# Altium schematic sheet opto_board_v1.0.SchDoc: Fixture Electronics Design
size A4; Revision: 1.0; SheetNumber: 1; SheetTotal: 1
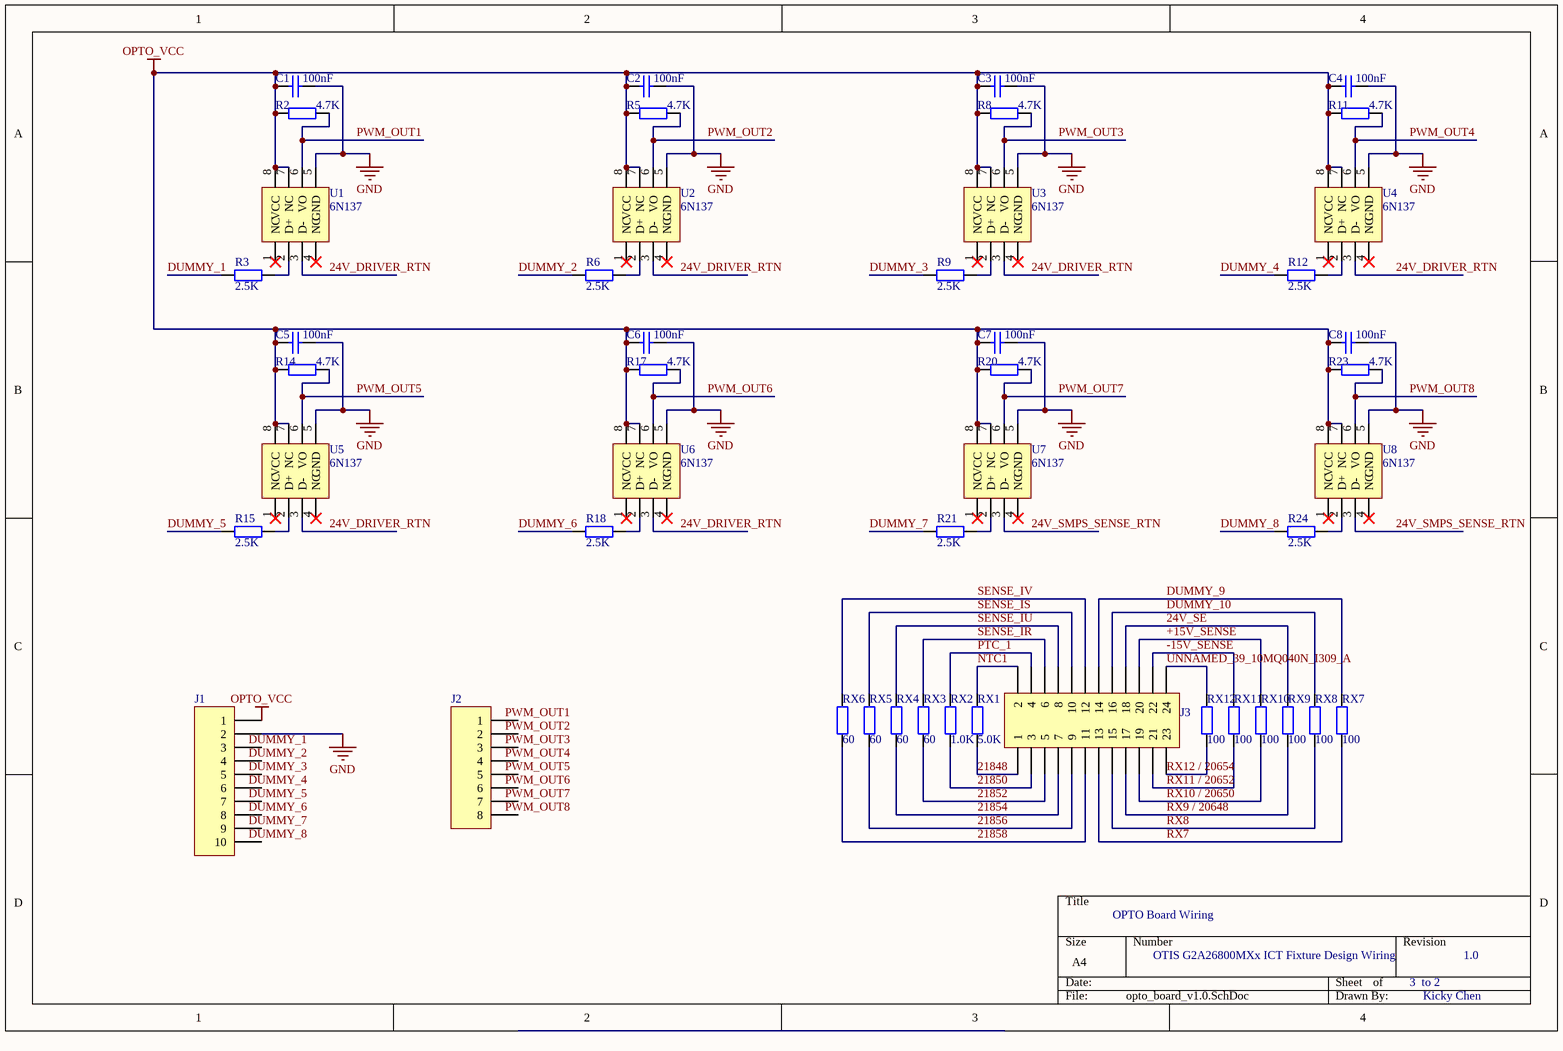
[diagram p0: opto_board_v1.0.SchDoc]

## Parts
C1  value 100nF  [RAD-0.3]  (hidden comment: Cap)
C2  value 100nF  [RAD-0.3]  (hidden comment: Cap)
C3  value 100nF  [RAD-0.3]  (hidden comment: Cap)
C4  value 100nF  [RAD-0.3]  (hidden comment: Cap)
C5  value 100nF  [RAD-0.3]  (hidden comment: Cap)
C6  value 100nF  [RAD-0.3]  (hidden comment: Cap)
C7  value 100nF  [RAD-0.3]  (hidden comment: Cap)
C8  value 100nF  [RAD-0.3]  (hidden comment: Cap)
J1  Header 10  [HDR1X10]  (value not drawn)
J2  Header 8  [HDR1X8]  (value not drawn)
J3  Header 12X2  [HDR2X12]  (value not drawn)
R2  value 4.7K  [AXIAL-0.4]  (hidden comment: Res2)
R3  value 2.5K  [AXIAL-0.4]  (hidden comment: Res2)
R5  value 4.7K  [AXIAL-0.4]  (hidden comment: Res2)
R6  value 2.5K  [AXIAL-0.4]  (hidden comment: Res2)
R8  value 4.7K  [AXIAL-0.4]  (hidden comment: Res2)
R9  value 2.5K  [AXIAL-0.4]  (hidden comment: Res2)
R11  value 4.7K  [AXIAL-0.4]  (hidden comment: Res2)
R12  value 2.5K  [AXIAL-0.4]  (hidden comment: Res2)
R14  value 4.7K  [AXIAL-0.4]  (hidden comment: Res2)
R15  value 2.5K  [AXIAL-0.4]  (hidden comment: Res2)
R17  value 4.7K  [AXIAL-0.4]  (hidden comment: Res2)
R18  value 2.5K  [AXIAL-0.4]  (hidden comment: Res2)
R20  value 4.7K  [AXIAL-0.4]  (hidden comment: Res2)
R21  value 2.5K  [AXIAL-0.4]  (hidden comment: Res2)
R23  value 4.7K  [AXIAL-0.4]  (hidden comment: Res2)
R24  value 2.5K  [AXIAL-0.4]  (hidden comment: Res2)
RX1  value 5.0K  [AXIAL-0.4]  (hidden comment: Res2)
RX2  value 1.0K  [AXIAL-0.4]  (hidden comment: Res2)
RX3  value 60  [AXIAL-0.4]  (hidden comment: Res2)
RX4  value 60  [AXIAL-0.4]  (hidden comment: Res2)
RX5  value 60  [AXIAL-0.4]  (hidden comment: Res2)
RX6  value 60  [AXIAL-0.4]  (hidden comment: Res2)
RX7  value 100  [AXIAL-0.4]  (hidden comment: Res2)
RX8  value 100  [AXIAL-0.4]  (hidden comment: Res2)
RX9  value 100  [AXIAL-0.4]  (hidden comment: Res2)
RX10  value 100  [AXIAL-0.4]  (hidden comment: Res2)
RX11  value 100  [AXIAL-0.4]  (hidden comment: Res2)
RX12  value 100  [AXIAL-0.4]  (hidden comment: Res2)
U1  6N137  [DIP8]
U2  6N137  [DIP8]
U3  6N137  [DIP8]
U4  6N137  [DIP8]
U5  6N137  [DIP8]
U6  6N137  [DIP8]
U7  6N137  [DIP8]
U8  6N137  [DIP8]

## Nets
GND: C1.1 C2.1 C3.1 C4.1 C5.1 C6.1 C7.1 C8.1 J1.2 U1.5(GND) U2.5(GND) U3.5(GND) U4.5(GND) U5.5(GND) U6.5(GND) U7.5(GND) U8.5(GND)
OPTO_VCC: C1.2 C2.2 C3.2 C4.2 C5.2 C6.2 C7.2 C8.2 J1.1 R2.2 R5.2 R8.2 R11.2 R14.2 R17.2 R20.2 R23.2 U1.7(NC) U1.8(VCC) U2.7(NC) U2.8(VCC) U3.7(NC) U3.8(VCC) U4.7(NC) U4.8(VCC) U5.7(NC) U5.8(VCC) U6.7(NC) U6.8(VCC) U7.7(NC) U7.8(VCC) U8.7(NC) U8.8(VCC)
24V_DRIVER_RTN: U1.3(D-) U2.3(D-) U3.3(D-) U4.3(D-) U5.3(D-) U6.3(D-)
24V_SE: J3.18 RX9.1
24V_SMPS_SENSE_RTN: U7.3(D-) U8.3(D-)
21848: J3.1 RX1.2
21850: J3.3 RX2.2
21852: J3.5 RX3.2
21854: J3.7 RX4.2
21856: J3.9 RX5.2
21858: J3.11 RX6.2
+15V_SENSE: J3.20 RX10.1
-15V_SENSE: J3.22 RX11.1
DUMMY_1: R3.2
DUMMY_2: R6.2
DUMMY_3: R9.2
DUMMY_4: R12.2
DUMMY_5: R15.2
DUMMY_6: R18.2
DUMMY_7: R21.2
DUMMY_8: R24.2
DUMMY_9: J3.14 RX7.1
DUMMY_10: J3.16 RX8.1
NTC1: J3.2 RX1.1
PTC_1: J3.4 RX2.1
PWM_OUT1: R2.1 U1.6(VO)
PWM_OUT2: R5.1 U2.6(VO)
PWM_OUT3: R8.1 U3.6(VO)
PWM_OUT4: R11.1 U4.6(VO)
PWM_OUT5: R14.1 U5.6(VO)
PWM_OUT6: R17.1 U6.6(VO)
PWM_OUT7: R20.1 U7.6(VO)
PWM_OUT8: R23.1 U8.6(VO)
RX7: J3.13 RX7.2
RX8: J3.15 RX8.2
RX9 / 20648: J3.17 RX9.2
RX10 / 20650: J3.19 RX10.2
RX11 / 20652: J3.21 RX11.2
RX12 / 20654: J3.23 RX12.2
SENSE_IR: J3.6 RX3.1
SENSE_IS: J3.10 RX5.1
SENSE_IU: J3.8 RX4.1
SENSE_IV: J3.12 RX6.1
UNNAMED_39_10MQ040N_I309_A: J3.24 RX12.1
NetR3_1: R3.1 U1.2(D+)
NetR6_1: R6.1 U2.2(D+)
NetR9_1: R9.1 U3.2(D+)
NetR12_1: R12.1 U4.2(D+)
NetR15_1: R15.1 U5.2(D+)
NetR18_1: R18.1 U6.2(D+)
NetR21_1: R21.1 U7.2(D+)
NetR24_1: R24.1 U8.2(D+)

Not connected (* = marked no-connect by the designer): J1 3 4 5 6 7 8 9 10; J2 1 2 3 4 5 6 7 8; U1 1(NC)* 4(NC)*; U2 1(NC)* 4(NC)*; U3 1(NC)* 4(NC)*; U4 1(NC)* 4(NC)*; U5 1(NC)* 4(NC)*; U6 1(NC)* 4(NC)*; U7 1(NC)* 4(NC)*; U8 1(NC)* 4(NC)*

## Notes on the sheet
- OPTO Board Wiring
- OTIS G2A26800MXx ICT Fixture Design Wiring
- 3  to 2
- 1.0
- Kicky Chen
- Labels drawn without touching a wire or pin: DUMMY_1, DUMMY_2, DUMMY_3, DUMMY_4, DUMMY_5, DUMMY_6, DUMMY_7, DUMMY_8, PWM_OUT1, PWM_OUT2, PWM_OUT3, PWM_OUT4, PWM_OUT5, PWM_OUT6, PWM_OUT7, PWM_OUT8

## Library data of the parts
C1-C8 = Cap: Capacitor; Published: 8-Jun-2000; LatestRevisionDate: 17-Jul-2002; LatestRevisionNote: Re-released for DXP Platform.; PackageReference: RAD-0.3; Publisher: Altium Limited
J1 = Header 10: Header, 10-Pin; LatestRevisionDate: 17-Jul-2002; LatestRevisionNote: Re-released for DXP Platform.; Publisher: Altium Limited
J2 = Header 8: Header, 8-Pin; LatestRevisionDate: 17-Jul-2002; LatestRevisionNote: Re-released for DXP Platform.; Publisher: Altium Limited
J3 = Header 12X2: Header, 12-Pin, Dual row; LatestRevisionDate: 17-Jul-2002; LatestRevisionNote: Re-released for DXP Platform.; Publisher: Altium Limited
R2 R3 R5 R6 R8 R9 R11 R12 R14 R15 R17 R18 R20 R21 R23 R24 RX1-RX12 = Res2: Resistor; Published: 8-Jun-2000; LatestRevisionDate: 17-Jul-2002; LatestRevisionNote: Re-released for DXP Platform.; PackageReference: AXIAL-0.4; Publisher: Altium Limited
U1-U8 = 6N137: Optocoupler